# EAGLE schematic muff-pi-clone (EAGLE 9.6.1)
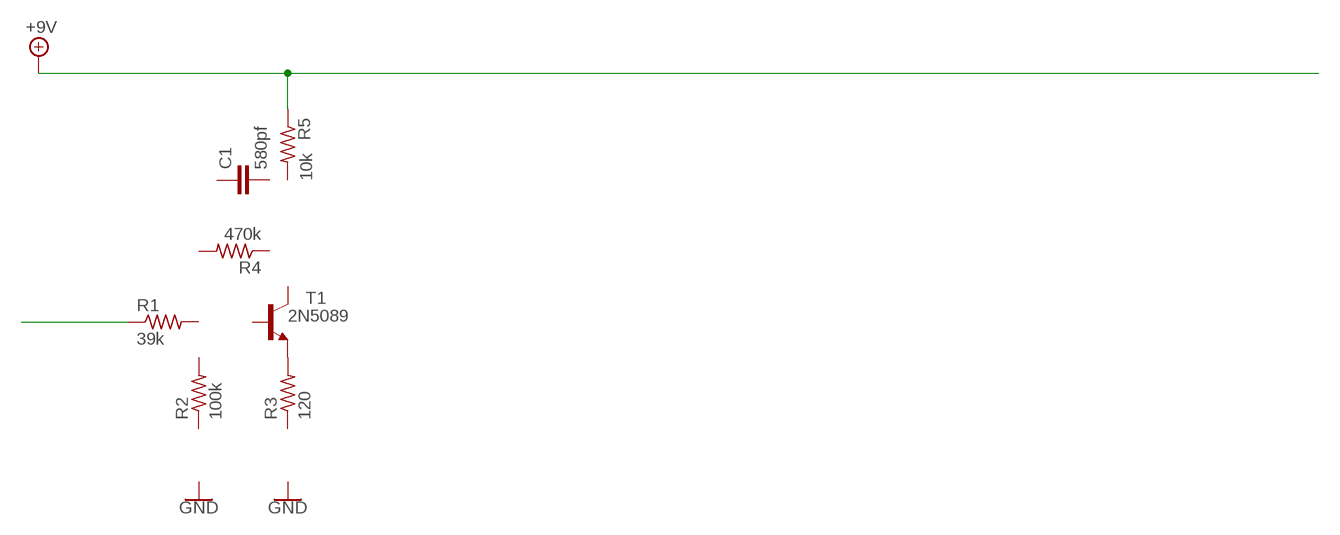
[diagram p0: schematic, sheet 1]

## Parts
C1  580pf  C-EU025-030X050  [C025-030X050]
R1  39k  R-US_0204/7  [0204/7]
R2  100k  R-US_0204/7  [0204/7]
R3  120  R-US_0204/7  [0204/7]
R4  470k  R-US_0204/7  [0204/7]
R5  10k  R-US_0204/7  [0204/7]
T1  2N5089  [TO92]

## Nets
+9V: R5.1
INPUT: R1.1
N$1: R3.2 T1.3(E)
Unconnected: C1.1 C1.2 R1.2 R2.1 R2.2 R3.1 R4.1 R4.2 R5.2 T1.1(C) T1.2(B)

## Library data of the parts
C1 = rcl:C-EU: CAPACITOR, European symbol; SPICEPREFIX: C
R1-R5 = rcl:R-US_: RESISTOR, American symbol; SPICEPREFIX: R
T1 = transistor:2N5089: NPN TRANSISTOR